# Altium project DIOT_Kasli_Adapter.PrjPCB (part 2 of 4)

## Sheet Cpcis_connectors_P4_P5_P6.SchDoc: DIOT_Kasli_Adapter
size 420 x 297 mm; CheckedBy: -; DrawnBy: Marcin Kiepiela; Address1: Warsaw University of Technology; Address2: Nowowiejska 15/19 00-665 Warsaw; DocumentNumber: 4; SheetNumber: 4; SheetTotal: 8; EDA_Number: ARTIQ; Projet: ARTIQ/Sinara/DIOT; ModifiedBy: -; CheckedDate: -; Title2: -; DivGrp: ISE; Designer: Marcin Kiepiela; ModifiedDate: -; ProjectName: DIOT_Kasli_Adapter.PrjPCB
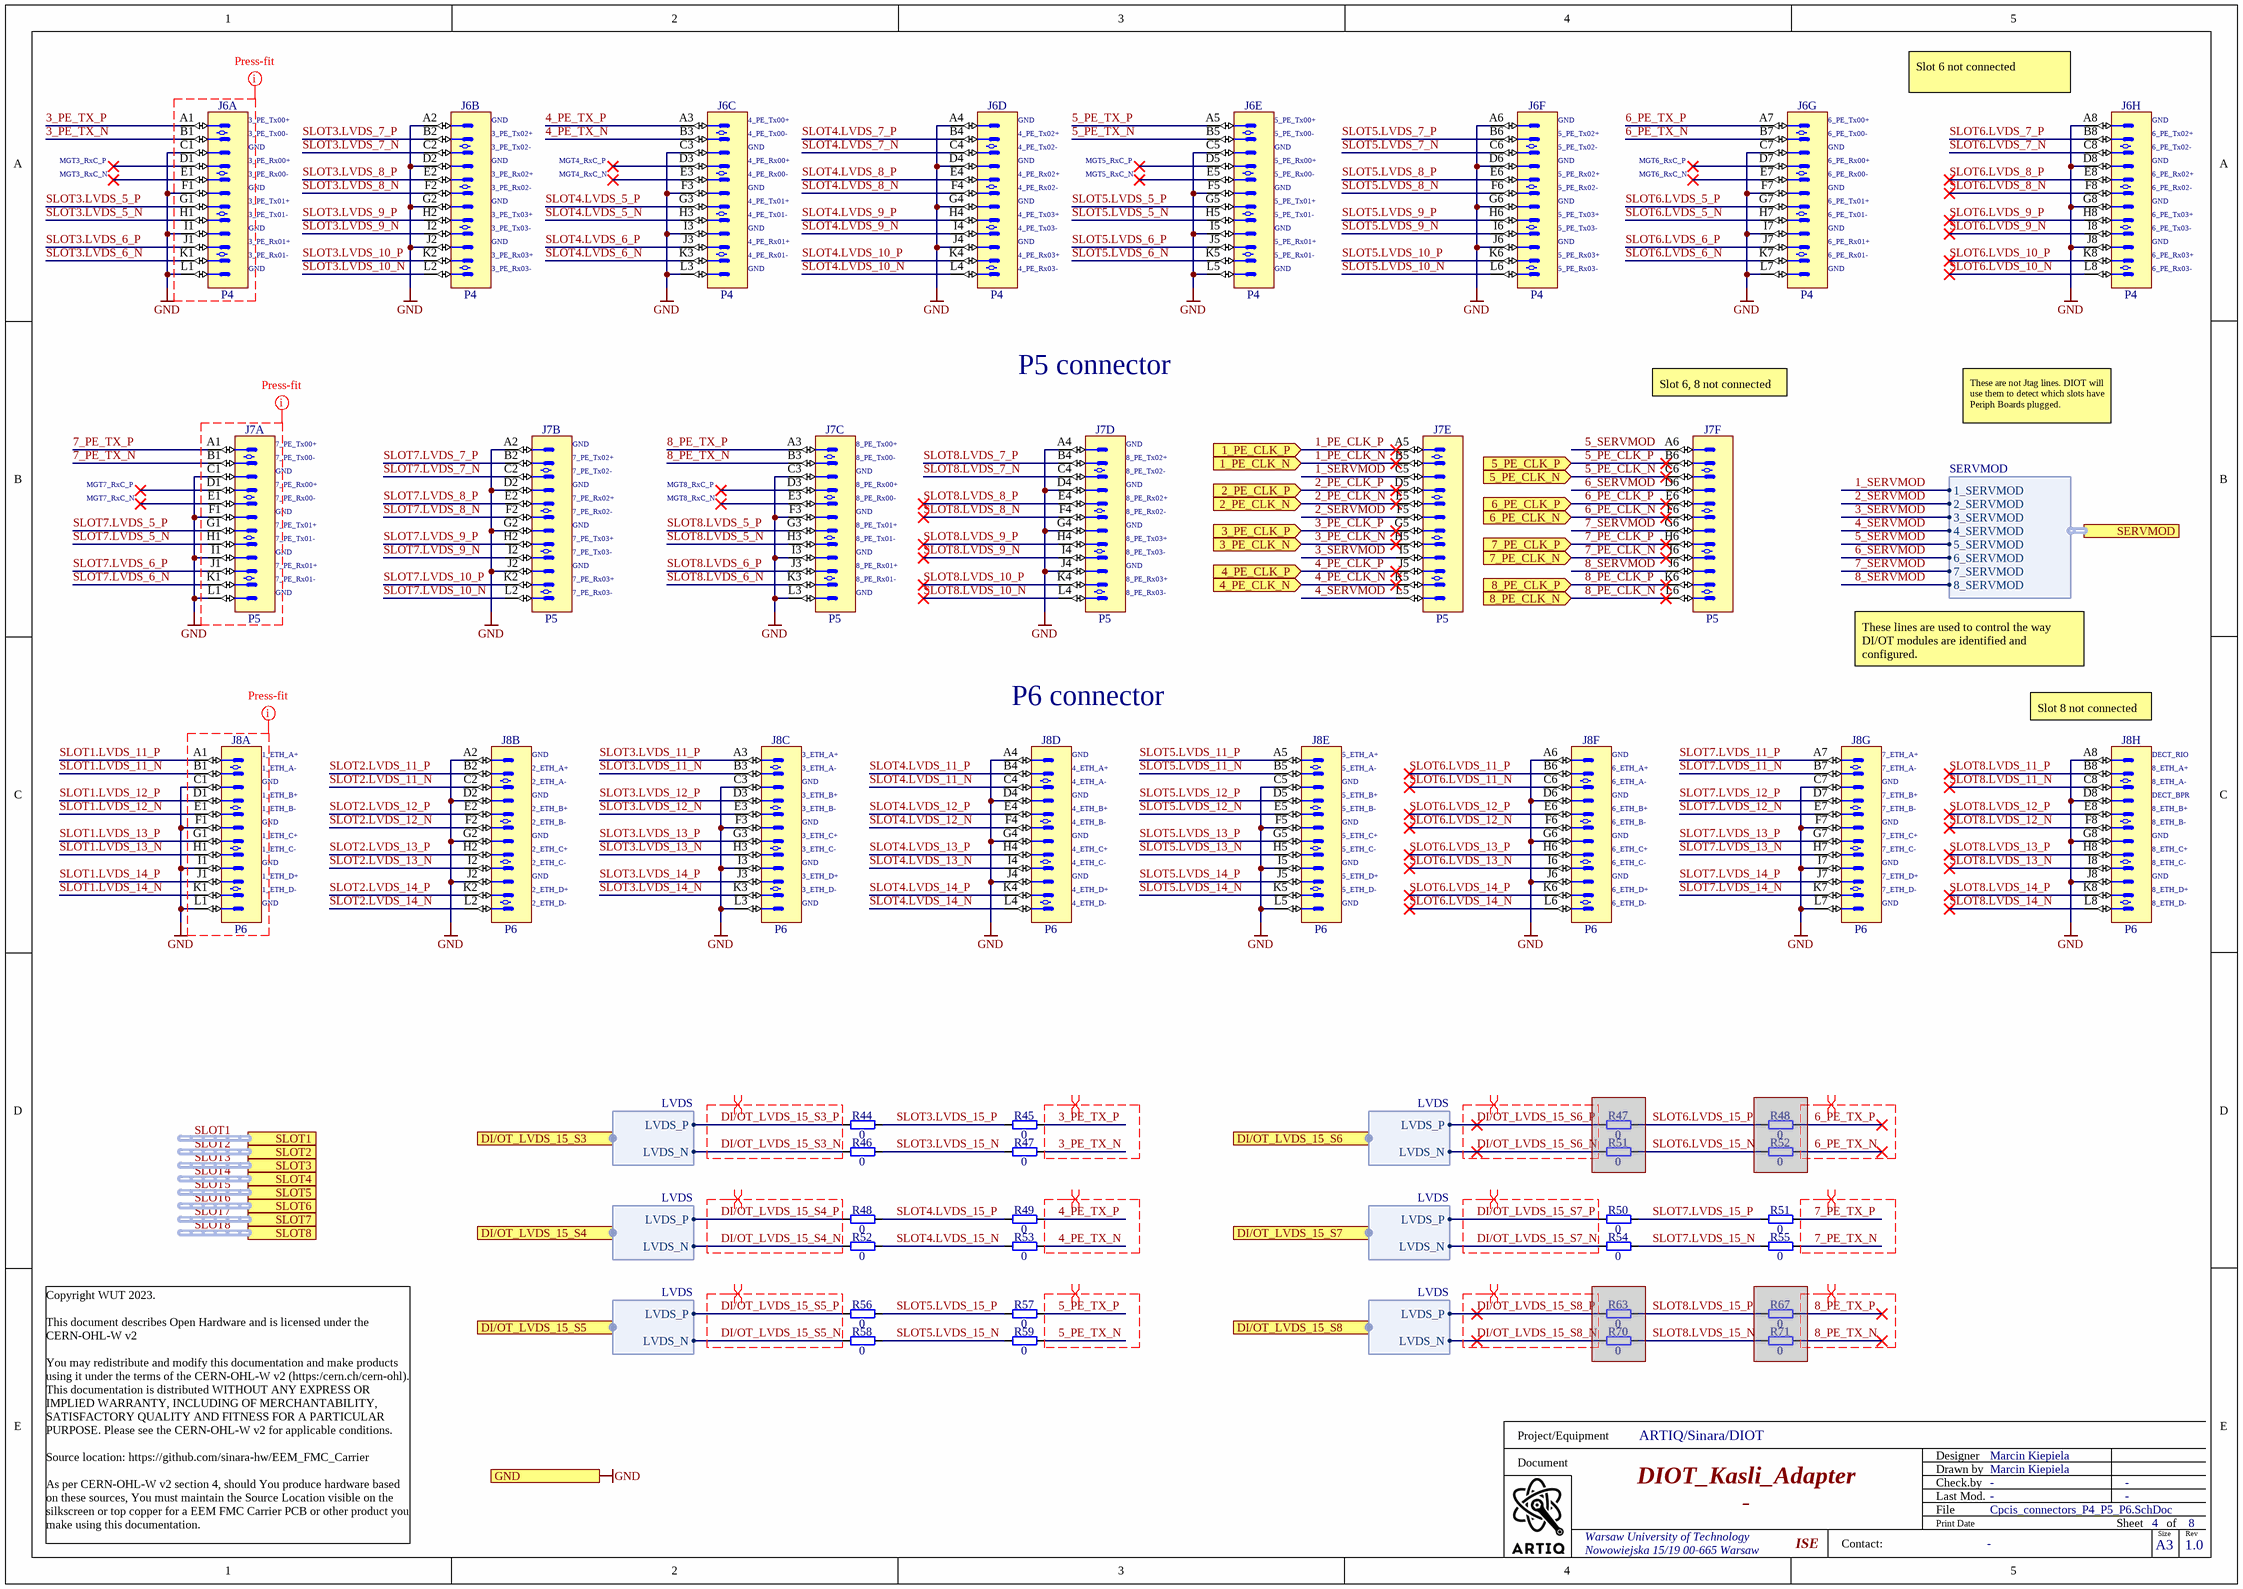
[diagram p2: Cpcis_connectors_P4_P5_P6.SchDoc]

### Parts
(Parts that share a designator on the sheet are numbered #1, #2 ... from top to bottom, then left to right.)
J6  P4  [AMPHENOL_10052837-101LF]  (parts A,B,C,D,E,F,G,H of 8)
J7  P5  [AMPHENOL_10052824-101LF]  (parts A,B,C,D,E,F of 6)
J8  P6  [AMPHENOL_10052838-101LF]  (parts A,B,C,D,E,F,G,H of 8)
R44  0  [RESC0603X28N]
R45  0  [RESC0603X28N]
R46  0  [RESC0603X28N]
R47#1  0  [RESC0603X28N]  (masked out: inside a compile mask, not in the netlist)
R47#2  0  [RESC0603X28N]
R48#1  0  [RESC0603X28N]  (masked out: inside a compile mask, not in the netlist)
R48#2  0  [RESC0603X28N]
R49  0  [RESC0603X28N]
R50  0  [RESC0603X28N]
R51#1  0  [RESC0603X28N]  (masked out: inside a compile mask, not in the netlist)
R51#2  0  [RESC0603X28N]
R52#1  0  [RESC0603X28N]  (masked out: inside a compile mask, not in the netlist)
R52#2  0  [RESC0603X28N]
R53  0  [RESC0603X28N]
R54  0  [RESC0603X28N]
R55  0  [RESC0603X28N]
R56  0  [RESC0603X28N]
R57  0  [RESC0603X28N]
R58  0  [RESC0603X28N]
R59  0  [RESC0603X28N]
R63  0  [RESC0603X28N]  (masked out: inside a compile mask, not in the netlist)
R67  0  [RESC0603X28N]  (masked out: inside a compile mask, not in the netlist)
R70  0  [RESC0603X28N]  (masked out: inside a compile mask, not in the netlist)
R71  0  [RESC0603X28N]  (masked out: inside a compile mask, not in the netlist)

### Ports
1_PE_CLK_N (in), 1_PE_CLK_P (in), 2_PE_CLK_N (in), 2_PE_CLK_P (in), 3_PE_CLK_N (in), 3_PE_CLK_P (in), 4_PE_CLK_N (in), 4_PE_CLK_P (in), 5_PE_CLK_N (in), 5_PE_CLK_P (in), 6_PE_CLK_N (in), 6_PE_CLK_P (in), 7_PE_CLK_N (in), 7_PE_CLK_P (in), 8_PE_CLK_N (in), 8_PE_CLK_P (in), DI/OT_LVDS_15_S3 (harness LVDS), DI/OT_LVDS_15_S4 (harness LVDS), DI/OT_LVDS_15_S5 (harness LVDS), DI/OT_LVDS_15_S6 (harness LVDS), DI/OT_LVDS_15_S7 (harness LVDS), DI/OT_LVDS_15_S8 (harness LVDS), GND, SERVMOD (harness SERVMOD), SLOT1 (harness SLOT), SLOT2 (harness SLOT), SLOT3 (harness SLOT), SLOT4 (harness SLOT), SLOT5 (harness SLOT), SLOT6 (harness ExtensionConnector), SLOT7 (harness SLOT), SLOT8 (harness ExtensionConnector)

### Harnesses
LVDS: LVDS_P, LVDS_N
SERVMOD: 5_SERVMOD, 6_SERVMOD, 2_SERVMOD, 7_SERVMOD, 3_SERVMOD, 4_SERVMOD, 1_SERVMOD, 8_SERVMOD

### Nets
GND: J6.A2 J6.A4 J6.A6 J6.A8 J6.C1 J6.C3 J6.C5 J6.C7 J6.D2 J6.D4 J6.D6 J6.D8 J6.F1 J6.F3 J6.F5 J6.F7 J6.G2 J6.G4 J6.G6 J6.G8 J6.I1 J6.I3 J6.I5 J6.I7 J6.J2 J6.J4 J6.J6 J6.J8 J6.L1 J6.L3 J6.L5 J6.L7 J7.A2 J7.A4 J7.C1 J7.C3 J7.D2 J7.D4 J7.F1 J7.F3 J7.G2 J7.G4 J7.I1 J7.I3 J7.J2 J7.J4 J7.L1 J7.L3 J8.A2 J8.A4 J8.A6 J8.A8 J8.C1 J8.C3 J8.C5 J8.C7 J8.D2 J8.D4 J8.D6 J8.D8 J8.F1 J8.F3 J8.F5 J8.F7 J8.G2 J8.G4 J8.G6 J8.G8 J8.I1 J8.I3 J8.I5 J8.I7 J8.J2 J8.J4 J8.J6 J8.J8 J8.L1 J8.L3 J8.L5 J8.L7 ; port GND
1_PE_CLK_N: J7.B5 ; port 1_PE_CLK_N
1_PE_CLK_P: J7.A5 ; port 1_PE_CLK_P
1_SERVMOD: J7.C5 ; port SERVMOD.1_SERVMOD  [project net SERVMOD.1_SERVMOD]
2_PE_CLK_N: J7.E5 ; port 2_PE_CLK_N
2_PE_CLK_P: J7.D5 ; port 2_PE_CLK_P
2_SERVMOD: J7.F5 ; port SERVMOD.2_SERVMOD  [project net SERVMOD.2_SERVMOD]
3_PE_CLK_N: J7.H5 ; port 3_PE_CLK_N
3_PE_CLK_P: J7.G5 ; port 3_PE_CLK_P
3_PE_TX_N: J6.B1 R47#2.2  [project net 3_PE_TX_N_4]
3_PE_TX_P: J6.A1 R45.2  [project net 3_PE_TX_P_4]
3_SERVMOD: J7.I5 ; port SERVMOD.3_SERVMOD  [project net SERVMOD.3_SERVMOD]
4_PE_CLK_N: J7.K5 ; port 4_PE_CLK_N
4_PE_CLK_P: J7.J5 ; port 4_PE_CLK_P
4_PE_TX_N: J6.B3 R53.2  [project net 4_PE_TX_N_4]
4_PE_TX_P: J6.A3 R49.2  [project net 4_PE_TX_P_4]
4_SERVMOD: J7.L5 ; port SERVMOD.4_SERVMOD  [project net SERVMOD.4_SERVMOD]
5_PE_CLK_N: J7.C6 ; port 5_PE_CLK_N
5_PE_CLK_P: J7.B6 ; port 5_PE_CLK_P
5_PE_TX_N: J6.B5 R59.2  [project net 5_PE_TX_N_4]
5_PE_TX_P: J6.A5 R57.2  [project net 5_PE_TX_P_4]
5_SERVMOD: J7.A6 ; port SERVMOD.5_SERVMOD  [project net SERVMOD.5_SERVMOD]
6_PE_CLK_N: J7.F6 ; port 6_PE_CLK_N
6_PE_CLK_P: J7.E6 ; port 6_PE_CLK_P
6_PE_TX_N: J6.B7  [project net 6_PE_TX_N_4]
6_PE_TX_P: J6.A7  [project net 6_PE_TX_P_4]
6_SERVMOD: J7.D6 ; port SERVMOD.6_SERVMOD  [project net SERVMOD.6_SERVMOD]
7_PE_CLK_N: J7.I6 ; port 7_PE_CLK_N
7_PE_CLK_P: J7.H6 ; port 7_PE_CLK_P
7_PE_TX_N: J7.B1 R55.2  [project net 7_PE_TX_N_4]
7_PE_TX_P: J7.A1 R51#2.2  [project net 7_PE_TX_P_4]
7_SERVMOD: J7.G6 ; port SERVMOD.7_SERVMOD  [project net SERVMOD.7_SERVMOD]
8_PE_CLK_N: J7.L6 ; port 8_PE_CLK_N
8_PE_CLK_P: J7.K6 ; port 8_PE_CLK_P
8_PE_TX_N: J7.B3  [project net 8_PE_TX_N_4]
8_PE_TX_P: J7.A3  [project net 8_PE_TX_P_4]
8_SERVMOD: J7.J6 ; port SERVMOD.8_SERVMOD  [project net SERVMOD.8_SERVMOD]
DI/OT_LVDS_15_S3_N: R46.1 ; port DI/OT_LVDS_15_S3.LVDS_N
DI/OT_LVDS_15_S3_P: R44.1 ; port DI/OT_LVDS_15_S3.LVDS_P
DI/OT_LVDS_15_S4_N: R52#2.1 ; port DI/OT_LVDS_15_S4.LVDS_N
DI/OT_LVDS_15_S4_P: R48#2.1 ; port DI/OT_LVDS_15_S4.LVDS_P
DI/OT_LVDS_15_S5_N: R58.1 ; port DI/OT_LVDS_15_S5.LVDS_N
DI/OT_LVDS_15_S5_P: R56.1 ; port DI/OT_LVDS_15_S5.LVDS_P
DI/OT_LVDS_15_S6_N: port DI/OT_LVDS_15_S6.LVDS_N
DI/OT_LVDS_15_S6_P: port DI/OT_LVDS_15_S6.LVDS_P
DI/OT_LVDS_15_S7_N: R54.1 ; port DI/OT_LVDS_15_S7.LVDS_N
DI/OT_LVDS_15_S7_P: R50.1 ; port DI/OT_LVDS_15_S7.LVDS_P
DI/OT_LVDS_15_S8_N: port DI/OT_LVDS_15_S8.LVDS_N
DI/OT_LVDS_15_S8_P: port DI/OT_LVDS_15_S8.LVDS_P
SLOT1.LVDS_11_N: J8.B1  [project net SLOT1.LVDS_11_N_4]
SLOT1.LVDS_11_P: J8.A1  [project net SLOT1.LVDS_11_P_4]
SLOT1.LVDS_12_N: J8.E1  [project net SLOT1.LVDS_12_N_4]
SLOT1.LVDS_12_P: J8.D1  [project net SLOT1.LVDS_12_P_4]
SLOT1.LVDS_13_N: J8.H1  [project net SLOT1.LVDS_13_N_4]
SLOT1.LVDS_13_P: J8.G1  [project net SLOT1.LVDS_13_P_4]
SLOT1.LVDS_14_N: J8.K1  [project net SLOT1.LVDS_14_N_4]
SLOT1.LVDS_14_P: J8.J1  [project net SLOT1.LVDS_14_P_4]
SLOT2.LVDS_11_N: J8.C2  [project net SLOT2.LVDS_11_N_4]
SLOT2.LVDS_11_P: J8.B2  [project net SLOT2.LVDS_11_P_4]
SLOT2.LVDS_12_N: J8.F2  [project net SLOT2.LVDS_12_N_4]
SLOT2.LVDS_12_P: J8.E2  [project net SLOT2.LVDS_12_P_4]
SLOT2.LVDS_13_N: J8.I2  [project net SLOT2.LVDS_13_N_4]
SLOT2.LVDS_13_P: J8.H2  [project net SLOT2.LVDS_13_P_4]
SLOT2.LVDS_14_N: J8.L2  [project net SLOT2.LVDS_14_N_4]
SLOT2.LVDS_14_P: J8.K2  [project net SLOT2.LVDS_14_P_4]
SLOT3.LVDS_5_N: J6.H1  [project net SLOT3.LVDS_5_N_4]
SLOT3.LVDS_5_P: J6.G1  [project net SLOT3.LVDS_5_P_4]
SLOT3.LVDS_6_N: J6.K1  [project net SLOT3.LVDS_6_N_4]
SLOT3.LVDS_6_P: J6.J1  [project net SLOT3.LVDS_6_P_4]
SLOT3.LVDS_7_N: J6.C2  [project net SLOT3.LVDS_7_N_4]
SLOT3.LVDS_7_P: J6.B2  [project net SLOT3.LVDS_7_P_4]
SLOT3.LVDS_8_N: J6.F2  [project net SLOT3.LVDS_8_N_4]
SLOT3.LVDS_8_P: J6.E2  [project net SLOT3.LVDS_8_P_4]
SLOT3.LVDS_9_N: J6.I2  [project net SLOT3.LVDS_9_N_4]
SLOT3.LVDS_9_P: J6.H2  [project net SLOT3.LVDS_9_P_4]
SLOT3.LVDS_10_N: J6.L2  [project net SLOT3.LVDS_10_N_4]
SLOT3.LVDS_10_P: J6.K2  [project net SLOT3.LVDS_10_P_4]
SLOT3.LVDS_11_N: J8.B3  [project net SLOT3.LVDS_11_N_4]
SLOT3.LVDS_11_P: J8.A3  [project net SLOT3.LVDS_11_P_4]
SLOT3.LVDS_12_N: J8.E3  [project net SLOT3.LVDS_12_N_4]
SLOT3.LVDS_12_P: J8.D3  [project net SLOT3.LVDS_12_P_4]
SLOT3.LVDS_13_N: J8.H3  [project net SLOT3.LVDS_13_N_4]
SLOT3.LVDS_13_P: J8.G3  [project net SLOT3.LVDS_13_P_4]
SLOT3.LVDS_14_N: J8.K3  [project net SLOT3.LVDS_14_N_4]
SLOT3.LVDS_14_P: J8.J3  [project net SLOT3.LVDS_14_P_4]
SLOT3.LVDS_15_N: R46.2 R47#2.1  [project net SLOT3.LVDS_15_N_4]
SLOT3.LVDS_15_P: R44.2 R45.1  [project net SLOT3.LVDS_15_P_4]
SLOT4.LVDS_5_N: J6.H3  [project net SLOT4.LVDS_5_N_4]
SLOT4.LVDS_5_P: J6.G3  [project net SLOT4.LVDS_5_P_4]
SLOT4.LVDS_6_N: J6.K3  [project net SLOT4.LVDS_6_N_4]
SLOT4.LVDS_6_P: J6.J3  [project net SLOT4.LVDS_6_P_4]
SLOT4.LVDS_7_N: J6.C4  [project net SLOT4.LVDS_7_N_4]
SLOT4.LVDS_7_P: J6.B4  [project net SLOT4.LVDS_7_P_4]
SLOT4.LVDS_8_N: J6.F4  [project net SLOT4.LVDS_8_N_4]
SLOT4.LVDS_8_P: J6.E4  [project net SLOT4.LVDS_8_P_4]
SLOT4.LVDS_9_N: J6.I4  [project net SLOT4.LVDS_9_N_4]
SLOT4.LVDS_9_P: J6.H4  [project net SLOT4.LVDS_9_P_4]
SLOT4.LVDS_10_N: J6.L4  [project net SLOT4.LVDS_10_N_4]
SLOT4.LVDS_10_P: J6.K4  [project net SLOT4.LVDS_10_P_4]
SLOT4.LVDS_11_N: J8.C4  [project net SLOT4.LVDS_11_N_4]
SLOT4.LVDS_11_P: J8.B4  [project net SLOT4.LVDS_11_P_4]
SLOT4.LVDS_12_N: J8.F4  [project net SLOT4.LVDS_12_N_4]
SLOT4.LVDS_12_P: J8.E4  [project net SLOT4.LVDS_12_P_4]
SLOT4.LVDS_13_N: J8.I4  [project net SLOT4.LVDS_13_N_4]
SLOT4.LVDS_13_P: J8.H4  [project net SLOT4.LVDS_13_P_4]
SLOT4.LVDS_14_N: J8.L4  [project net SLOT4.LVDS_14_N_4]
SLOT4.LVDS_14_P: J8.K4  [project net SLOT4.LVDS_14_P_4]
SLOT4.LVDS_15_N: R52#2.2 R53.1  [project net SLOT4.LVDS_15_N_4]
SLOT4.LVDS_15_P: R48#2.2 R49.1  [project net SLOT4.LVDS_15_P_4]
SLOT5.LVDS_5_N: J6.H5  [project net SLOT5.LVDS_5_N_4]
SLOT5.LVDS_5_P: J6.G5  [project net SLOT5.LVDS_5_P_4]
SLOT5.LVDS_6_N: J6.K5  [project net SLOT5.LVDS_6_N_4]
SLOT5.LVDS_6_P: J6.J5  [project net SLOT5.LVDS_6_P_4]
SLOT5.LVDS_7_N: J6.C6  [project net SLOT5.LVDS_7_N_4]
SLOT5.LVDS_7_P: J6.B6  [project net SLOT5.LVDS_7_P_4]
SLOT5.LVDS_8_N: J6.F6  [project net SLOT5.LVDS_8_N_4]
SLOT5.LVDS_8_P: J6.E6  [project net SLOT5.LVDS_8_P_4]
SLOT5.LVDS_9_N: J6.I6  [project net SLOT5.LVDS_9_N_4]
SLOT5.LVDS_9_P: J6.H6  [project net SLOT5.LVDS_9_P_4]
SLOT5.LVDS_10_N: J6.L6  [project net SLOT5.LVDS_10_N_4]
SLOT5.LVDS_10_P: J6.K6  [project net SLOT5.LVDS_10_P_4]
SLOT5.LVDS_11_N: J8.B5  [project net SLOT5.LVDS_11_N_4]
SLOT5.LVDS_11_P: J8.A5  [project net SLOT5.LVDS_11_P_4]
SLOT5.LVDS_12_N: J8.E5  [project net SLOT5.LVDS_12_N_4]
SLOT5.LVDS_12_P: J8.D5  [project net SLOT5.LVDS_12_P_4]
SLOT5.LVDS_13_N: J8.H5  [project net SLOT5.LVDS_13_N_4]
SLOT5.LVDS_13_P: J8.G5  [project net SLOT5.LVDS_13_P_4]
SLOT5.LVDS_14_N: J8.K5  [project net SLOT5.LVDS_14_N_4]
SLOT5.LVDS_14_P: J8.J5  [project net SLOT5.LVDS_14_P_4]
SLOT5.LVDS_15_N: R58.2 R59.1  [project net SLOT5.LVDS_15_N_4]
SLOT5.LVDS_15_P: R56.2 R57.1  [project net SLOT5.LVDS_15_P_4]
SLOT6.LVDS_5_N: J6.H7  [project net SLOT6.LVDS_5_N_4]
SLOT6.LVDS_5_P: J6.G7  [project net SLOT6.LVDS_5_P_4]
SLOT6.LVDS_6_N: J6.K7  [project net SLOT6.LVDS_6_N_4]
SLOT6.LVDS_6_P: J6.J7  [project net SLOT6.LVDS_6_P_4]
SLOT6.LVDS_7_N: J6.C8  [project net SLOT6.LVDS_7_N_4]
SLOT6.LVDS_7_P: J6.B8  [project net SLOT6.LVDS_7_P_4]
SLOT6.LVDS_8_N: J6.F8  [project net SLOT6.LVDS_8_N_4]
SLOT6.LVDS_8_P: J6.E8  [project net SLOT6.LVDS_8_P_4]
SLOT6.LVDS_9_N: J6.I8  [project net SLOT6.LVDS_9_N_4]
SLOT6.LVDS_9_P: J6.H8  [project net SLOT6.LVDS_9_P_4]
SLOT6.LVDS_10_N: J6.L8  [project net SLOT6.LVDS_10_N_4]
SLOT6.LVDS_10_P: J6.K8  [project net SLOT6.LVDS_10_P_4]
SLOT6.LVDS_11_N: J8.C6  [project net SLOT6.LVDS_11_N_4]
SLOT6.LVDS_11_P: J8.B6  [project net SLOT6.LVDS_11_P_4]
SLOT6.LVDS_12_N: J8.F6  [project net SLOT6.LVDS_12_N_4]
SLOT6.LVDS_12_P: J8.E6  [project net SLOT6.LVDS_12_P_4]
SLOT6.LVDS_13_N: J8.I6  [project net SLOT6.LVDS_13_N_4]
SLOT6.LVDS_13_P: J8.H6  [project net SLOT6.LVDS_13_P_4]
SLOT6.LVDS_14_N: J8.L6  [project net SLOT6.LVDS_14_N_4]
SLOT6.LVDS_14_P: J8.K6  [project net SLOT6.LVDS_14_P_4]
SLOT7.LVDS_5_N: J7.H1  [project net SLOT7.LVDS_5_N_4]
SLOT7.LVDS_5_P: J7.G1  [project net SLOT7.LVDS_5_P_4]
SLOT7.LVDS_6_N: J7.K1  [project net SLOT7.LVDS_6_N_4]
SLOT7.LVDS_6_P: J7.J1  [project net SLOT7.LVDS_6_P_4]
SLOT7.LVDS_7_N: J7.C2  [project net SLOT7.LVDS_7_N_4]
SLOT7.LVDS_7_P: J7.B2  [project net SLOT7.LVDS_7_P_4]
SLOT7.LVDS_8_N: J7.F2  [project net SLOT7.LVDS_8_N_4]
SLOT7.LVDS_8_P: J7.E2  [project net SLOT7.LVDS_8_P_4]
SLOT7.LVDS_9_N: J7.I2  [project net SLOT7.LVDS_9_N_4]
SLOT7.LVDS_9_P: J7.H2  [project net SLOT7.LVDS_9_P_4]
SLOT7.LVDS_10_N: J7.L2  [project net SLOT7.LVDS_10_N_4]
SLOT7.LVDS_10_P: J7.K2  [project net SLOT7.LVDS_10_P_4]
SLOT7.LVDS_11_N: J8.B7  [project net SLOT7.LVDS_11_N_4]
SLOT7.LVDS_11_P: J8.A7  [project net SLOT7.LVDS_11_P_4]
SLOT7.LVDS_12_N: J8.E7  [project net SLOT7.LVDS_12_N_4]
SLOT7.LVDS_12_P: J8.D7  [project net SLOT7.LVDS_12_P_4]
SLOT7.LVDS_13_N: J8.H7  [project net SLOT7.LVDS_13_N_4]
SLOT7.LVDS_13_P: J8.G7  [project net SLOT7.LVDS_13_P_4]
SLOT7.LVDS_14_N: J8.K7  [project net SLOT7.LVDS_14_N_4]
SLOT7.LVDS_14_P: J8.J7  [project net SLOT7.LVDS_14_P_4]
SLOT7.LVDS_15_N: R54.2 R55.1  [project net SLOT7.LVDS_15_N_4]
SLOT7.LVDS_15_P: R50.2 R51#2.1  [project net SLOT7.LVDS_15_P_4]
SLOT8.LVDS_5_N: J7.H3  [project net SLOT8.LVDS_5_N_4]
SLOT8.LVDS_5_P: J7.G3  [project net SLOT8.LVDS_5_P_4]
SLOT8.LVDS_6_N: J7.K3  [project net SLOT8.LVDS_6_N_4]
SLOT8.LVDS_6_P: J7.J3  [project net SLOT8.LVDS_6_P_4]
SLOT8.LVDS_7_N: J7.C4  [project net SLOT8.LVDS_7_N_4]
SLOT8.LVDS_7_P: J7.B4  [project net SLOT8.LVDS_7_P_4]
SLOT8.LVDS_8_N: J7.F4  [project net SLOT8.LVDS_8_N_4]
SLOT8.LVDS_8_P: J7.E4  [project net SLOT8.LVDS_8_P_4]
SLOT8.LVDS_9_N: J7.I4  [project net SLOT8.LVDS_9_N_4]
SLOT8.LVDS_9_P: J7.H4  [project net SLOT8.LVDS_9_P_4]
SLOT8.LVDS_10_N: J7.L4  [project net SLOT8.LVDS_10_N_4]
SLOT8.LVDS_10_P: J7.K4  [project net SLOT8.LVDS_10_P_4]
SLOT8.LVDS_11_N: J8.C8  [project net SLOT8.LVDS_11_N_4]
SLOT8.LVDS_11_P: J8.B8  [project net SLOT8.LVDS_11_P_4]
SLOT8.LVDS_12_N: J8.F8  [project net SLOT8.LVDS_12_N_4]
SLOT8.LVDS_12_P: J8.E8  [project net SLOT8.LVDS_12_P_4]
SLOT8.LVDS_13_N: J8.I8  [project net SLOT8.LVDS_13_N_4]
SLOT8.LVDS_13_P: J8.H8  [project net SLOT8.LVDS_13_P_4]
SLOT8.LVDS_14_N: J8.L8  [project net SLOT8.LVDS_14_N_4]
SLOT8.LVDS_14_P: J8.K8  [project net SLOT8.LVDS_14_P_4]

Not connected (* = marked no-connect by the designer): J6 D1* D3* D5* D7* E1* E3* E5* E7*; J7 D1* D3* E1* E3*

### Buses and harness runs
harness SLOT1 = port SLOT1
harness SLOT2 = port SLOT2
harness SLOT3 = port SLOT3
harness SLOT4 = port SLOT4
harness SLOT5 = port SLOT5
harness SLOT6 = port SLOT6
harness SLOT7 = port SLOT7
harness SLOT8 = port SLOT8

### Layout directives
differential pair: 3_PE_TX_N, 3_PE_TX_P, 4_PE_TX_N, 4_PE_TX_P, 5_PE_TX_N, 5_PE_TX_P, 6_PE_TX_N, 6_PE_TX_P, 7_PE_TX_N, 7_PE_TX_P, 8_PE_TX_N, 8_PE_TX_P, DI/OT_LVDS_15_S3_N, DI/OT_LVDS_15_S3_P, DI/OT_LVDS_15_S4_N, DI/OT_LVDS_15_S4_P, DI/OT_LVDS_15_S5_N, DI/OT_LVDS_15_S5_P, DI/OT_LVDS_15_S6_N, DI/OT_LVDS_15_S6_P, DI/OT_LVDS_15_S7_N, DI/OT_LVDS_15_S7_P, DI/OT_LVDS_15_S8_N, DI/OT_LVDS_15_S8_P
CompClassName: Press-fit: (no net found under the mark)

### Notes on the sheet
- (near J6) 3_PE_Tx00+
- (near J6) GND
- (near J6) 4_PE_Tx00+
- (near J6) 5_PE_Tx00+
- (near J6) 6_PE_Tx00+
- (near J6) Slot 6 not connected
- MGT3_RxC_P
- MGT3_RxC_N
- (near J6) 3_PE_Tx00-
- (near J6) 3_PE_Rx00+
- (near J6) 3_PE_Rx00-
- (near J6) 3_PE_Tx02+
- (near J6) 3_PE_Tx02-
- (near J6) 3_PE_Rx02+
- (near J6) 3_PE_Rx02-
- MGT4_RxC_P
- MGT4_RxC_N
- (near J6) 4_PE_Tx00-
- (near J6) 4_PE_Rx00+
- (near J6) 4_PE_Rx00-
- (near J6) 4_PE_Tx02+
- (near J6) 4_PE_Tx02-
- (near J6) 4_PE_Rx02+
- (near J6) 4_PE_Rx02-
- MGT5_RxC_P
- MGT5_RxC_N
- (near J6) 5_PE_Tx00-
- (near J6) 5_PE_Rx00+
- (near J6) 5_PE_Rx00-
- (near J6) 5_PE_Tx02+
- (near J6) 5_PE_Tx02-
- (near J6) 5_PE_Rx02+
- (near J6) 5_PE_Rx02-
- MGT6_RxC_P
- MGT6_RxC_N
- (near J6) 6_PE_Tx00-
- (near J6) 6_PE_Rx00+
- (near J6) 6_PE_Rx00-
- (near J6) 6_PE_Tx02+
- (near J6) 6_PE_Tx02-
- (near J6) 6_PE_Rx02+
- (near J6) 6_PE_Rx02-
- (near J6) 3_PE_Tx01+
- (near J6) 3_PE_Tx01-
- (near J6) 3_PE_Rx01+
- (near J6) 3_PE_Rx01-
- (near J6) 3_PE_Tx03+
- (near J6) 3_PE_Tx03-
- (near J6) 3_PE_Rx03+
- (near J6) 4_PE_Tx01+
- (near J6) 4_PE_Tx01-
- (near J6) 4_PE_Rx01+
- (near J6) 4_PE_Rx01-
- (near J6) 4_PE_Tx03+
- (near J6) 4_PE_Tx03-
- (near J6) 4_PE_Rx03+
- (near J6) 5_PE_Tx01+
- (near J6) 5_PE_Tx01-
- (near J6) 5_PE_Rx01+
- (near J6) 5_PE_Rx01-
- (near J6) 5_PE_Tx03+
- (near J6) 5_PE_Tx03-
- (near J6) 5_PE_Rx03+
- (near J6) 6_PE_Tx01+
- (near J6) 6_PE_Tx01-
- (near J6) 6_PE_Rx01+
- (near J6) 6_PE_Rx01-
- (near J6) 6_PE_Tx03+
- (near J6) 6_PE_Tx03-
- (near J6) 6_PE_Rx03+
- (near J6) 3_PE_Rx03-
- (near J6) 4_PE_Rx03-
- (near J6) 5_PE_Rx03-
- (near J6) 6_PE_Rx03-
- P5 connector
- Slot 6, 8 not connected
- (near J7) 7_PE_Tx00+
- (near J7) 7_PE_Tx00-
- (near J7) GND
- (near J7) 7_PE_Tx02+
- (near J7) 8_PE_Tx00+
- (near J7) 8_PE_Tx00-
- (near J7) 8_PE_Tx02+
- These are not Jtag lines. DIOT will use them to detect which slots have Periph Boards plugged.
- MGT7_RxC_P
- MGT7_RxC_N
- (near J7) 7_PE_Tx01+
- (near J7) 7_PE_Rx00+
- (near J7) 7_PE_Rx00-
- (near J7) 7_PE_Tx02-
- (near J7) 7_PE_Rx02+
- (near J7) 7_PE_Rx02-
- MGT8_RxC_P
- MGT8_RxC_N
- (near J7) 8_PE_Tx01+
- (near J7) 8_PE_Rx00+
- (near J7) 8_PE_Rx00-
- (near J7) 8_PE_Tx02-
- (near J7) 8_PE_Rx02+
- (near J7) 8_PE_Rx02-
- (near J7) 7_PE_Tx01-
- (near J7) 7_PE_Rx01+
- (near J7) 7_PE_Rx01-
- (near J7) 7_PE_Tx03+
- (near J7) 7_PE_Tx03-
- (near J7) 7_PE_Rx03+
- (near J7) 7_PE_Rx03-
- (near J7) 8_PE_Tx01-
- (near J7) 8_PE_Rx01+
- (near J7) 8_PE_Rx01-
- (near J7) 8_PE_Tx03+
- (near J7) 8_PE_Tx03-
- (near J7) 8_PE_Rx03+
- (near J7) 8_PE_Rx03-
- These lines are used to control the way DI/OT modules are identified and configured.
- (near J8) P6 connector
- (near J8) Slot 8 not connected
- (near J8) 1_ETH_A+
- (near J8) 1_ETH_A-
- (near J8) GND
- (near J8) 1_ETH_B+
- (near J8) 2_ETH_A+
- (near J8) 2_ETH_A-
- (near J8) 3_ETH_A+
- (near J8) 3_ETH_A-
- (near J8) 3_ETH_B+
- (near J8) 4_ETH_A+
- (near J8) 4_ETH_A-
- (near J8) 5_ETH_A+
- (near J8) 5_ETH_A-
- (near J8) 5_ETH_B+
- (near J8) 6_ETH_A+
- (near J8) 6_ETH_A-
- (near J8) 7_ETH_A+
- (near J8) 7_ETH_A-
- (near J8) 7_ETH_B+
- (near J8) DECT_RIO
- (near J8) 8_ETH_A+
- (near J8) 8_ETH_A-
- (near J8) DECT_BPR
- (near J8) 1_ETH_B-
- (near J8) 1_ETH_C+
- (near J8) 1_ETH_C-
- (near J8) 2_ETH_B+
- (near J8) 2_ETH_B-
- (near J8) 2_ETH_C+
- (near J8) 2_ETH_C-
- (near J8) 3_ETH_B-
- (near J8) 3_ETH_C+
- (near J8) 3_ETH_C-
- (near J8) 4_ETH_B+
- (near J8) 4_ETH_B-
- (near J8) 4_ETH_C+
- (near J8) 4_ETH_C-
- (near J8) 5_ETH_B-
- (near J8) 5_ETH_C+
- (near J8) 5_ETH_C-
- (near J8) 6_ETH_B+
- (near J8) 6_ETH_B-
- (near J8) 6_ETH_C+
- (near J8) 6_ETH_C-
- (near J8) 7_ETH_B-
- (near J8) 7_ETH_C+
- (near J8) 7_ETH_C-
- (near J8) 8_ETH_B+
- (near J8) 8_ETH_B-
- (near J8) 8_ETH_C+
- (near J8) 8_ETH_C-
- (near J8) 1_ETH_D+
- (near J8) 1_ETH_D-
- (near J8) 2_ETH_D+
- (near J8) 2_ETH_D-
- (near J8) 3_ETH_D+
- (near J8) 3_ETH_D-
- (near J8) 4_ETH_D+
- (near J8) 4_ETH_D-
- (near J8) 5_ETH_D+
- (near J8) 5_ETH_D-
- (near J8) 6_ETH_D+
- (near J8) 6_ETH_D-
- (near J8) 7_ETH_D+
- (near J8) 7_ETH_D-
- (near J8) 8_ETH_D+
- (near J8) 8_ETH_D-
- Labels drawn without touching a wire or pin: SLOT6.LVDS_15_N, SLOT6.LVDS_15_P, SLOT8.LVDS_15_N, SLOT8.LVDS_15_P
- Project/Equipment
- Document
- Designer
- Drawn by
- Check.by
- Copyright WUT 2023.
  This document describes Open Hardware and is licensed under the CERN-OHL-W v2
  You may redistribute and modify this documentation and make products using it under the terms of the CERN-OHL-W v2 (https:/cern.ch/cern-ohl). This documentation is distributed WITHOUT ANY EXPRESS OR IMPLIED WARRANTY, INCLUDING OF MERCHANTABILITY, SATISFACTORY QUALITY AND FITNESS FOR A PARTICULAR PURPOSE. Please see the CERN-OHL-W v2 for applicable conditions.
  Source location: https://github.com/sinara-hw/EEM_FMC_Carrier
  As per CERN-OHL-W v2 section 4, should You produce hardware based on these sources, You must maintain the Source Location visible on the silkscreen or top copper for a EEM FMC Carrier PCB or other product you make using this documentation.
- Contact:
- File
- Last Mod.
- Print Date
- Sheet
- Size
- A3
- of
- Rev

### Library data of the parts
J6 = AMPHENOL_10052837-101LF: 96 Contacts Header, 8 Columns, 4 Pairs per Column; Part Description: 96 Contacts, 2mm Pitch, 8 Columns, 4 Pairs per Column, 2 Walls, Right Angle Header; Part Number: AMPHENOL_10052837-101LF; Component Kind: Standard; Component Type: Standard; Pin Count: 96; Family: AirMax VS; Mounted: Yes; Socket: No; SMD: No; PressFit: Yes; Sense: No; Status: None; Manufacturer: AMPHENOL; Manufacturer Part Number: 10052837-101LF; ComponentHeight: 15.35mm; HelpURL: \\cern.ch\dfs\Applications\Altium\Datasheets\AMPHENOL_10052837-101LF.pdf; ComponentLink1URL: \\cern.ch\dfs\Applications\Altium\Datasheets\AMPHENOL_10052837-101LF_Application.pdf; ComponentLink1Description: Application; Author: CERN DEM MR; CreateDate: 19/02/2018; LatestRevisionDate: 19/02/2018
J7 = AMPHENOL_10052824-101LF: 72 Contacts Header, 6 Columns, 4 Pairs per Column; Part Description: 72 Contacts, 2mm Pitch, 6 Columns, 4 Pairs per Column, 2 Walls, Right Angle Header; Part Number: AMPHENOL_10052824-101LF; Component Kind: Standard; Component Type: Standard; Pin Count: 72; Family: AirMax VS; Mounted: Yes; Socket: No; SMD: No; PressFit: Yes; Sense: No; Status: None; Manufacturer: AMPHENOL; Manufacturer Part Number: 10052824-101LF; ComponentHeight: 15.35mm; HelpURL: \\cern.ch\dfs\Applications\Altium\Datasheets\AMPHENOL_10052824-101LF.pdf; ComponentLink1URL: \\cern.ch\dfs\Applications\Altium\Datasheets\AMPHENOL_10052824-101LF_Application.pdf; ComponentLink1Description: Application; Author: CERN DEM JMW; CreateDate: 29/11/2017; LatestRevisionDate: 29/11/2017
J8 = AMPHENOL_10052838-101LF: 96 Contacts Header, 8 Columns, 4 Pairs per Column; Part Description: 96 Contacts, 2mm Pitch, 8 Columns, 4 Pairs per Column, 4 Walls, Right Angle Header; Part Number: AMPHENOL_10052838-101LF; Component Kind: Standard; Component Type: Standard; Pin Count: 96; Family: AirMax VS; Mounted: Yes; Socket: No; SMD: No; PressFit: Yes; Sense: No; Status: None; Manufacturer: AMPHENOL; Manufacturer Part Number: 10052838-101LF; ComponentHeight: 15.35mm; HelpURL: \\cern.ch\dfs\Applications\Altium\Datasheets\AMPHENOL_10052838-101LF.pdf; ComponentLink1URL: \\cern.ch\dfs\Applications\Altium\Datasheets\AMPHENOL_10052838-101LF_Application.pdf; ComponentLink1Description: Application; Author: CERN DEM MR; CreateDate: 19/02/2018; LatestRevisionDate: 19/02/2018; Classname: Overlapping
R44-R46 R47#1 R47#2 R48#1 R48#2 R49 R50 R51#1 R51#2 R52#1 R52#2 R53-R59 R63 R67 R70 R71 = R0201_0R_JUMPER: Resistor; Part Description: 1A (0.05R Max DC Resistance) Zero Ohm Jumper; Manufacturer: GENERIC; Manufacturer1 Part Number: CRCW02010000Z0ED; PressFit: No; Part Number: R0201_0R_JUMPER; Component Kind: Standard; Component Type: Standard; Pin Count: 2; Value: 0; Status: Not Recommended; Manufacturer Part Number: R0201_0R_JUMPER; Case: 0201; Mounted: Yes; Sense: No; Socket: No; SMD: Yes; Manufacturer1 Example: VISHAY; Manufacturer1 ComponentHeight: 0.27mm; HelpURL: \\cern.ch\dfs\Applications\Altium\Datasheets\R0201_VISHAY_CRCW e3.pdf; Author: CERN DEM JLC; CreateDate: 19.11.2014; LatestRevisionDate: 08.01.2015

## Sheet IDC_EXT_Connectors.SchDoc: DIOT_Kasli_Adapter
size 420 x 297 mm; CheckedBy: -; DrawnBy: Marcin Kiepiela; Address1: Warsaw University of Technology; Address2: Nowowiejska 15/19 00-665 Warsaw; DocumentNumber: 5; SheetNumber: 5; SheetTotal: 8; EDA_Number: ARTIQ; Projet: ARTIQ/Sinara/DIOT; ModifiedBy: -; CheckedDate: -; Title2: -; DivGrp: ISE; Designer: Marcin Kiepiela; ModifiedDate: -; ProjectName: DIOT_Kasli_Adapter.PrjPCB
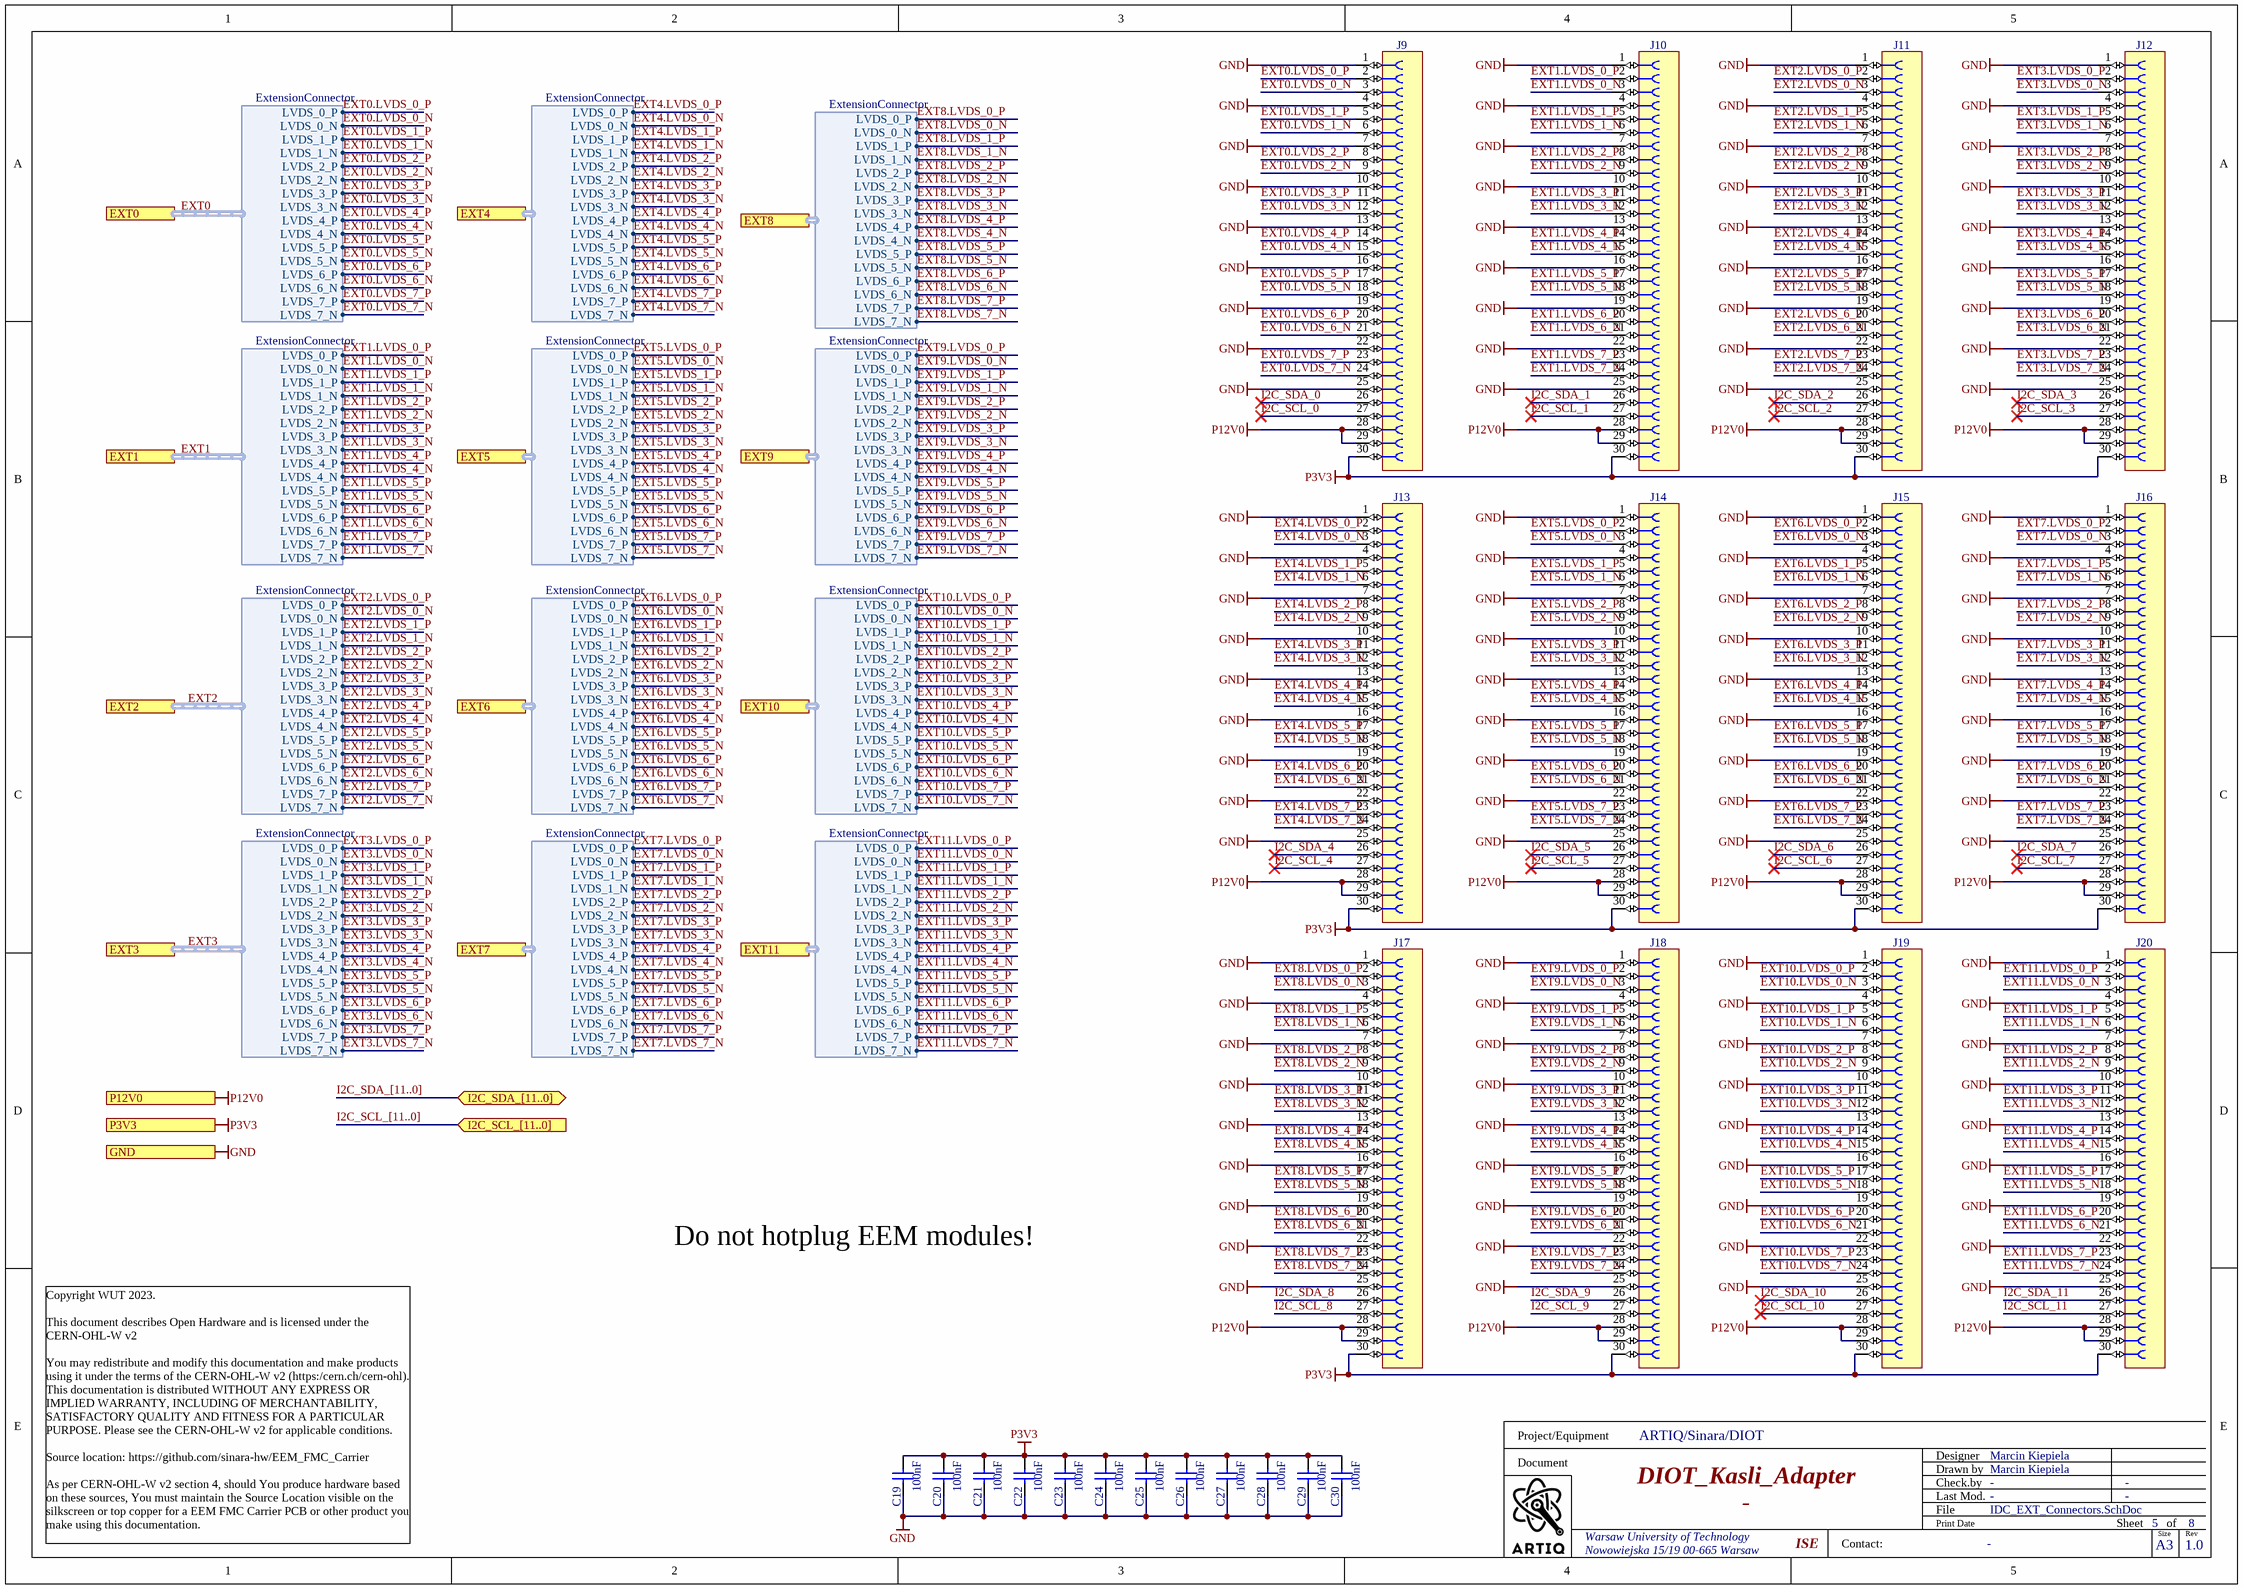
[diagram p3: IDC_EXT_Connectors.SchDoc]

### Parts
C19  100nF  [CAPC0603X33N]
C20  100nF  [CAPC0603X33N]
C21  100nF  [CAPC0603X33N]
C22  100nF  [CAPC0603X33N]
C23  100nF  [CAPC0603X33N]
C24  100nF  [CAPC0603X33N]
C25  100nF  [CAPC0603X33N]
C26  100nF  [CAPC0603X33N]
C27  100nF  [CAPC0603X33N]
C28  100nF  [CAPC0603X33N]
C29  100nF  [CAPC0603X33N]
C30  100nF  [CAPC0603X33N]
J9  (no value)  [SAMTEC_ESW-115-44-L-D]
J10  (no value)  [SAMTEC_ESW-115-44-L-D]
J11  (no value)  [SAMTEC_ESW-115-44-L-D]
J12  (no value)  [SAMTEC_ESW-115-44-L-D]
J13  (no value)  [SAMTEC_ESW-115-44-L-D]
J14  (no value)  [SAMTEC_ESW-115-44-L-D]
J15  (no value)  [SAMTEC_ESW-115-44-L-D]
J16  (no value)  [SAMTEC_ESW-115-44-L-D]
J17  (no value)  [SAMTEC_ESW-115-44-L-D]
J18  (no value)  [SAMTEC_ESW-115-44-L-D]
J19  (no value)  [SAMTEC_ESW-115-44-L-D]
J20  (no value)  [SAMTEC_ESW-115-44-L-D]

### Ports
EXT0 (harness ExtensionConnector), EXT1 (harness ExtensionConnector), EXT2 (harness ExtensionConnector), EXT3 (harness ExtensionConnector), EXT4 (harness ExtensionConnector), EXT5 (harness ExtensionConnector), EXT6 (harness ExtensionConnector), EXT7 (harness ExtensionConnector), EXT8 (harness ExtensionConnector), EXT9 (harness ExtensionConnector), EXT10 (harness ExtensionConnector), EXT11 (harness ExtensionConnector), GND, I2C_SCL_[11..0] (in), I2C_SDA_[11..0] (bidir), P3V3 (out), P12V0 (in)

### Harnesses
ExtensionConnector: LVDS_0_N, LVDS_0_P, LVDS_1_N, LVDS_1_P, LVDS_2_N, LVDS_2_P, LVDS_3_N, LVDS_3_P, LVDS_4_N, LVDS_4_P, LVDS_5_N, LVDS_5_P, LVDS_6_N, LVDS_6_P, LVDS_7_N, LVDS_7_P

### Nets
GND: C19.1 C20.1 C21.1 C22.1 C23.1 C24.1 C25.1 C26.1 C27.1 C28.1 C29.1 C30.1 J9.1 J9.4 J9.7 J9.10 J9.13 J9.16 J9.19 J9.22 J9.25 J10.1 J10.4 J10.7 J10.10 J10.13 J10.16 J10.19 J10.22 J10.25 J11.1 J11.4 J11.7 J11.10 J11.13 J11.16 J11.19 J11.22 J11.25 J12.1 J12.4 J12.7 J12.10 J12.13 J12.16 J12.19 J12.22 J12.25 J13.1 J13.4 J13.7 J13.10 J13.13 J13.16 J13.19 J13.22 J13.25 J14.1 J14.4 J14.7 J14.10 J14.13 J14.16 J14.19 J14.22 J14.25 J15.1 J15.4 J15.7 J15.10 J15.13 J15.16 J15.19 J15.22 J15.25 J16.1 J16.4 J16.7 J16.10 J16.13 J16.16 J16.19 J16.22 J16.25 J17.1 J17.4 J17.7 J17.10 J17.13 J17.16 J17.19 J17.22 J17.25 J18.1 J18.4 J18.7 J18.10 J18.13 J18.16 J18.19 J18.22 J18.25 J19.1 J19.4 J19.7 J19.10 J19.13 J19.16 J19.19 J19.22 J19.25 J20.1 J20.4 J20.7 J20.10 J20.13 J20.16 J20.19 J20.22 J20.25 ; port GND
P3V3: C19.2 C20.2 C21.2 C22.2 C23.2 C24.2 C25.2 C26.2 C27.2 C28.2 C29.2 C30.2 J9.30 J10.30 J11.30 J12.30 J13.30 J14.30 J15.30 J16.30 J17.30 J18.30 J19.30 J20.30 ; port P3V3
P12V0: J9.28 J9.29 J10.28 J10.29 J11.28 J11.29 J12.28 J12.29 J13.28 J13.29 J14.28 J14.29 J15.28 J15.29 J16.28 J16.29 J17.28 J17.29 J18.28 J18.29 J19.28 J19.29 J20.28 J20.29 ; port P12V0
EXT0.LVDS_0_N: J9.3 ; port EXT0.LVDS_0_N
EXT0.LVDS_0_P: J9.2 ; port EXT0.LVDS_0_P
EXT0.LVDS_1_N: J9.6 ; port EXT0.LVDS_1_N
EXT0.LVDS_1_P: J9.5 ; port EXT0.LVDS_1_P
EXT0.LVDS_2_N: J9.9 ; port EXT0.LVDS_2_N
EXT0.LVDS_2_P: J9.8 ; port EXT0.LVDS_2_P
EXT0.LVDS_3_N: J9.12 ; port EXT0.LVDS_3_N
EXT0.LVDS_3_P: J9.11 ; port EXT0.LVDS_3_P
EXT0.LVDS_4_N: J9.15 ; port EXT0.LVDS_4_N
EXT0.LVDS_4_P: J9.14 ; port EXT0.LVDS_4_P
EXT0.LVDS_5_N: J9.18 ; port EXT0.LVDS_5_N
EXT0.LVDS_5_P: J9.17 ; port EXT0.LVDS_5_P
EXT0.LVDS_6_N: J9.21 ; port EXT0.LVDS_6_N
EXT0.LVDS_6_P: J9.20 ; port EXT0.LVDS_6_P
EXT0.LVDS_7_N: J9.24 ; port EXT0.LVDS_7_N
EXT0.LVDS_7_P: J9.23 ; port EXT0.LVDS_7_P
EXT1.LVDS_0_N: J10.3 ; port EXT1.LVDS_0_N
EXT1.LVDS_0_P: J10.2 ; port EXT1.LVDS_0_P
EXT1.LVDS_1_N: J10.6 ; port EXT1.LVDS_1_N
EXT1.LVDS_1_P: J10.5 ; port EXT1.LVDS_1_P
EXT1.LVDS_2_N: J10.9 ; port EXT1.LVDS_2_N
EXT1.LVDS_2_P: J10.8 ; port EXT1.LVDS_2_P
EXT1.LVDS_3_N: J10.12 ; port EXT1.LVDS_3_N
EXT1.LVDS_3_P: J10.11 ; port EXT1.LVDS_3_P
EXT1.LVDS_4_N: J10.15 ; port EXT1.LVDS_4_N
EXT1.LVDS_4_P: J10.14 ; port EXT1.LVDS_4_P
EXT1.LVDS_5_N: J10.18 ; port EXT1.LVDS_5_N
EXT1.LVDS_5_P: J10.17 ; port EXT1.LVDS_5_P
EXT1.LVDS_6_N: J10.21 ; port EXT1.LVDS_6_N
EXT1.LVDS_6_P: J10.20 ; port EXT1.LVDS_6_P
EXT1.LVDS_7_N: J10.24 ; port EXT1.LVDS_7_N
EXT1.LVDS_7_P: J10.23 ; port EXT1.LVDS_7_P
EXT2.LVDS_0_N: J11.3 ; port EXT2.LVDS_0_N
EXT2.LVDS_0_P: J11.2 ; port EXT2.LVDS_0_P
EXT2.LVDS_1_N: J11.6 ; port EXT2.LVDS_1_N
EXT2.LVDS_1_P: J11.5 ; port EXT2.LVDS_1_P
EXT2.LVDS_2_N: J11.9 ; port EXT2.LVDS_2_N
EXT2.LVDS_2_P: J11.8 ; port EXT2.LVDS_2_P
EXT2.LVDS_3_N: J11.12 ; port EXT2.LVDS_3_N
EXT2.LVDS_3_P: J11.11 ; port EXT2.LVDS_3_P
EXT2.LVDS_4_N: J11.15 ; port EXT2.LVDS_4_N
EXT2.LVDS_4_P: J11.14 ; port EXT2.LVDS_4_P
EXT2.LVDS_5_N: J11.18 ; port EXT2.LVDS_5_N
EXT2.LVDS_5_P: J11.17 ; port EXT2.LVDS_5_P
EXT2.LVDS_6_N: J11.21 ; port EXT2.LVDS_6_N
EXT2.LVDS_6_P: J11.20 ; port EXT2.LVDS_6_P
EXT2.LVDS_7_N: J11.24 ; port EXT2.LVDS_7_N
EXT2.LVDS_7_P: J11.23 ; port EXT2.LVDS_7_P
EXT3.LVDS_0_N: J12.3 ; port EXT3.LVDS_0_N
EXT3.LVDS_0_P: J12.2 ; port EXT3.LVDS_0_P
EXT3.LVDS_1_N: J12.6 ; port EXT3.LVDS_1_N
EXT3.LVDS_1_P: J12.5 ; port EXT3.LVDS_1_P
EXT3.LVDS_2_N: J12.9 ; port EXT3.LVDS_2_N
EXT3.LVDS_2_P: J12.8 ; port EXT3.LVDS_2_P
EXT3.LVDS_3_N: J12.12 ; port EXT3.LVDS_3_N
EXT3.LVDS_3_P: J12.11 ; port EXT3.LVDS_3_P
EXT3.LVDS_4_N: J12.15 ; port EXT3.LVDS_4_N
EXT3.LVDS_4_P: J12.14 ; port EXT3.LVDS_4_P
EXT3.LVDS_5_N: J12.18 ; port EXT3.LVDS_5_N
EXT3.LVDS_5_P: J12.17 ; port EXT3.LVDS_5_P
EXT3.LVDS_6_N: J12.21 ; port EXT3.LVDS_6_N
EXT3.LVDS_6_P: J12.20 ; port EXT3.LVDS_6_P
EXT3.LVDS_7_N: J12.24 ; port EXT3.LVDS_7_N
EXT3.LVDS_7_P: J12.23 ; port EXT3.LVDS_7_P
EXT4.LVDS_0_N: J13.3 ; port EXT4.LVDS_0_N
EXT4.LVDS_0_P: J13.2 ; port EXT4.LVDS_0_P
EXT4.LVDS_1_N: J13.6 ; port EXT4.LVDS_1_N
EXT4.LVDS_1_P: J13.5 ; port EXT4.LVDS_1_P
EXT4.LVDS_2_N: J13.9 ; port EXT4.LVDS_2_N
EXT4.LVDS_2_P: J13.8 ; port EXT4.LVDS_2_P
EXT4.LVDS_3_N: J13.12 ; port EXT4.LVDS_3_N
EXT4.LVDS_3_P: J13.11 ; port EXT4.LVDS_3_P
EXT4.LVDS_4_N: J13.15 ; port EXT4.LVDS_4_N
EXT4.LVDS_4_P: J13.14 ; port EXT4.LVDS_4_P
EXT4.LVDS_5_N: J13.18 ; port EXT4.LVDS_5_N
EXT4.LVDS_5_P: J13.17 ; port EXT4.LVDS_5_P
EXT4.LVDS_6_N: J13.21 ; port EXT4.LVDS_6_N
EXT4.LVDS_6_P: J13.20 ; port EXT4.LVDS_6_P
EXT4.LVDS_7_N: J13.24 ; port EXT4.LVDS_7_N
EXT4.LVDS_7_P: J13.23 ; port EXT4.LVDS_7_P
EXT5.LVDS_0_N: J14.3 ; port EXT5.LVDS_0_N
EXT5.LVDS_0_P: J14.2 ; port EXT5.LVDS_0_P
EXT5.LVDS_1_N: J14.6 ; port EXT5.LVDS_1_N
EXT5.LVDS_1_P: J14.5 ; port EXT5.LVDS_1_P
EXT5.LVDS_2_N: J14.9 ; port EXT5.LVDS_2_N
EXT5.LVDS_2_P: J14.8 ; port EXT5.LVDS_2_P
EXT5.LVDS_3_N: J14.12 ; port EXT5.LVDS_3_N
EXT5.LVDS_3_P: J14.11 ; port EXT5.LVDS_3_P
EXT5.LVDS_4_N: J14.15 ; port EXT5.LVDS_4_N
EXT5.LVDS_4_P: J14.14 ; port EXT5.LVDS_4_P
EXT5.LVDS_5_N: J14.18 ; port EXT5.LVDS_5_N
EXT5.LVDS_5_P: J14.17 ; port EXT5.LVDS_5_P
EXT5.LVDS_6_N: J14.21 ; port EXT5.LVDS_6_N
EXT5.LVDS_6_P: J14.20 ; port EXT5.LVDS_6_P
EXT5.LVDS_7_N: J14.24 ; port EXT5.LVDS_7_N
EXT5.LVDS_7_P: J14.23 ; port EXT5.LVDS_7_P
EXT6.LVDS_0_N: J15.3 ; port EXT6.LVDS_0_N
EXT6.LVDS_0_P: J15.2 ; port EXT6.LVDS_0_P
EXT6.LVDS_1_N: J15.6 ; port EXT6.LVDS_1_N
EXT6.LVDS_1_P: J15.5 ; port EXT6.LVDS_1_P
EXT6.LVDS_2_N: J15.9 ; port EXT6.LVDS_2_N
EXT6.LVDS_2_P: J15.8 ; port EXT6.LVDS_2_P
EXT6.LVDS_3_N: J15.12 ; port EXT6.LVDS_3_N
EXT6.LVDS_3_P: J15.11 ; port EXT6.LVDS_3_P
EXT6.LVDS_4_N: J15.15 ; port EXT6.LVDS_4_N
EXT6.LVDS_4_P: J15.14 ; port EXT6.LVDS_4_P
EXT6.LVDS_5_N: J15.18 ; port EXT6.LVDS_5_N
EXT6.LVDS_5_P: J15.17 ; port EXT6.LVDS_5_P
EXT6.LVDS_6_N: J15.21 ; port EXT6.LVDS_6_N
EXT6.LVDS_6_P: J15.20 ; port EXT6.LVDS_6_P
EXT6.LVDS_7_N: J15.24 ; port EXT6.LVDS_7_N
EXT6.LVDS_7_P: J15.23 ; port EXT6.LVDS_7_P
EXT7.LVDS_0_N: J16.3 ; port EXT7.LVDS_0_N
EXT7.LVDS_0_P: J16.2 ; port EXT7.LVDS_0_P
EXT7.LVDS_1_N: J16.6 ; port EXT7.LVDS_1_N
EXT7.LVDS_1_P: J16.5 ; port EXT7.LVDS_1_P
EXT7.LVDS_2_N: J16.9 ; port EXT7.LVDS_2_N
EXT7.LVDS_2_P: J16.8 ; port EXT7.LVDS_2_P
EXT7.LVDS_3_N: J16.12 ; port EXT7.LVDS_3_N
EXT7.LVDS_3_P: J16.11 ; port EXT7.LVDS_3_P
EXT7.LVDS_4_N: J16.15 ; port EXT7.LVDS_4_N
EXT7.LVDS_4_P: J16.14 ; port EXT7.LVDS_4_P
EXT7.LVDS_5_N: J16.18 ; port EXT7.LVDS_5_N
EXT7.LVDS_5_P: J16.17 ; port EXT7.LVDS_5_P
EXT7.LVDS_6_N: J16.21 ; port EXT7.LVDS_6_N
EXT7.LVDS_6_P: J16.20 ; port EXT7.LVDS_6_P
EXT7.LVDS_7_N: J16.24 ; port EXT7.LVDS_7_N
EXT7.LVDS_7_P: J16.23 ; port EXT7.LVDS_7_P
EXT8.LVDS_0_N: J17.3 ; port EXT8.LVDS_0_N
EXT8.LVDS_0_P: J17.2 ; port EXT8.LVDS_0_P
EXT8.LVDS_1_N: J17.6 ; port EXT8.LVDS_1_N
EXT8.LVDS_1_P: J17.5 ; port EXT8.LVDS_1_P
EXT8.LVDS_2_N: J17.9 ; port EXT8.LVDS_2_N
EXT8.LVDS_2_P: J17.8 ; port EXT8.LVDS_2_P
EXT8.LVDS_3_N: J17.12 ; port EXT8.LVDS_3_N
EXT8.LVDS_3_P: J17.11 ; port EXT8.LVDS_3_P
EXT8.LVDS_4_N: J17.15 ; port EXT8.LVDS_4_N
EXT8.LVDS_4_P: J17.14 ; port EXT8.LVDS_4_P
EXT8.LVDS_5_N: J17.18 ; port EXT8.LVDS_5_N
EXT8.LVDS_5_P: J17.17 ; port EXT8.LVDS_5_P
EXT8.LVDS_6_N: J17.21 ; port EXT8.LVDS_6_N
EXT8.LVDS_6_P: J17.20 ; port EXT8.LVDS_6_P
EXT8.LVDS_7_N: J17.24 ; port EXT8.LVDS_7_N
EXT8.LVDS_7_P: J17.23 ; port EXT8.LVDS_7_P
EXT9.LVDS_0_N: J18.3 ; port EXT9.LVDS_0_N
EXT9.LVDS_0_P: J18.2 ; port EXT9.LVDS_0_P
EXT9.LVDS_1_N: J18.6 ; port EXT9.LVDS_1_N
EXT9.LVDS_1_P: J18.5 ; port EXT9.LVDS_1_P
EXT9.LVDS_2_N: J18.9 ; port EXT9.LVDS_2_N
EXT9.LVDS_2_P: J18.8 ; port EXT9.LVDS_2_P
EXT9.LVDS_3_N: J18.12 ; port EXT9.LVDS_3_N
EXT9.LVDS_3_P: J18.11 ; port EXT9.LVDS_3_P
EXT9.LVDS_4_N: J18.15 ; port EXT9.LVDS_4_N
EXT9.LVDS_4_P: J18.14 ; port EXT9.LVDS_4_P
EXT9.LVDS_5_N: J18.18 ; port EXT9.LVDS_5_N
EXT9.LVDS_5_P: J18.17 ; port EXT9.LVDS_5_P
EXT9.LVDS_6_N: J18.21 ; port EXT9.LVDS_6_N
EXT9.LVDS_6_P: J18.20 ; port EXT9.LVDS_6_P
EXT9.LVDS_7_N: J18.24 ; port EXT9.LVDS_7_N
EXT9.LVDS_7_P: J18.23 ; port EXT9.LVDS_7_P
EXT10.LVDS_0_N: J19.3 ; port EXT10.LVDS_0_N
EXT10.LVDS_0_P: J19.2 ; port EXT10.LVDS_0_P
EXT10.LVDS_1_N: J19.6 ; port EXT10.LVDS_1_N
EXT10.LVDS_1_P: J19.5 ; port EXT10.LVDS_1_P
EXT10.LVDS_2_N: J19.9 ; port EXT10.LVDS_2_N
EXT10.LVDS_2_P: J19.8 ; port EXT10.LVDS_2_P
EXT10.LVDS_3_N: J19.12 ; port EXT10.LVDS_3_N
EXT10.LVDS_3_P: J19.11 ; port EXT10.LVDS_3_P
EXT10.LVDS_4_N: J19.15 ; port EXT10.LVDS_4_N
EXT10.LVDS_4_P: J19.14 ; port EXT10.LVDS_4_P
EXT10.LVDS_5_N: J19.18 ; port EXT10.LVDS_5_N
EXT10.LVDS_5_P: J19.17 ; port EXT10.LVDS_5_P
EXT10.LVDS_6_N: J19.21 ; port EXT10.LVDS_6_N
EXT10.LVDS_6_P: J19.20 ; port EXT10.LVDS_6_P
EXT10.LVDS_7_N: J19.24 ; port EXT10.LVDS_7_N
EXT10.LVDS_7_P: J19.23 ; port EXT10.LVDS_7_P
EXT11.LVDS_0_N: J20.3 ; port EXT11.LVDS_0_N
EXT11.LVDS_0_P: J20.2 ; port EXT11.LVDS_0_P
EXT11.LVDS_1_N: J20.6 ; port EXT11.LVDS_1_N
EXT11.LVDS_1_P: J20.5 ; port EXT11.LVDS_1_P
EXT11.LVDS_2_N: J20.9 ; port EXT11.LVDS_2_N
EXT11.LVDS_2_P: J20.8 ; port EXT11.LVDS_2_P
EXT11.LVDS_3_N: J20.12 ; port EXT11.LVDS_3_N
EXT11.LVDS_3_P: J20.11 ; port EXT11.LVDS_3_P
EXT11.LVDS_4_N: J20.15 ; port EXT11.LVDS_4_N
EXT11.LVDS_4_P: J20.14 ; port EXT11.LVDS_4_P
EXT11.LVDS_5_N: J20.18 ; port EXT11.LVDS_5_N
EXT11.LVDS_5_P: J20.17 ; port EXT11.LVDS_5_P
EXT11.LVDS_6_N: J20.21 ; port EXT11.LVDS_6_N
EXT11.LVDS_6_P: J20.20 ; port EXT11.LVDS_6_P
EXT11.LVDS_7_N: J20.24 ; port EXT11.LVDS_7_N
EXT11.LVDS_7_P: J20.23 ; port EXT11.LVDS_7_P
I2C_SCL_0: J9.27  [project net I2C_SCL_0_1]
I2C_SCL_1: J10.27  [project net I2C_SCL_1_1]
I2C_SCL_2: J11.27  [project net I2C_SCL_2_1]
I2C_SCL_3: J12.27  [project net I2C_SCL_3_1]
I2C_SCL_4: J13.27  [project net I2C_SCL_4_1]
I2C_SCL_5: J14.27  [project net I2C_SCL_5_1]
I2C_SCL_6: J15.27  [project net I2C_SCL_6_1]
I2C_SCL_7: J16.27  [project net I2C_SCL_7_1]
I2C_SCL_8: J17.27
I2C_SCL_9: J18.27
I2C_SCL_10: J19.27  [project net I2C_SCL_10_1]
I2C_SCL_11: J20.27
I2C_SDA_0: J9.26  [project net I2C_SDA_0_1]
I2C_SDA_1: J10.26  [project net I2C_SDA_1_1]
I2C_SDA_2: J11.26  [project net I2C_SDA_2_1]
I2C_SDA_3: J12.26  [project net I2C_SDA_3_1]
I2C_SDA_4: J13.26  [project net I2C_SDA_4_1]
I2C_SDA_5: J14.26  [project net I2C_SDA_5_1]
I2C_SDA_6: J15.26  [project net I2C_SDA_6_1]
I2C_SDA_7: J16.26  [project net I2C_SDA_7_1]
I2C_SDA_8: J17.26
I2C_SDA_9: J18.26
I2C_SDA_10: J19.26  [project net I2C_SDA_10_1]
I2C_SDA_11: J20.26

### Buses and harness runs
bus I2C_SCL_[11..0] = port I2C_SCL_[11..0]
bus I2C_SDA_[11..0] = port I2C_SDA_[11..0]
harness EXT0 = port EXT0
harness EXT1 = port EXT1
harness EXT2 = port EXT2
harness EXT3 = port EXT3

### Notes on the sheet
- Do not hotplug EEM modules!
- Project/Equipment
- Document
- Designer
- Drawn by
- Check.by
- Copyright WUT 2023.
  This document describes Open Hardware and is licensed under the CERN-OHL-W v2
  You may redistribute and modify this documentation and make products using it under the terms of the CERN-OHL-W v2 (https:/cern.ch/cern-ohl). This documentation is distributed WITHOUT ANY EXPRESS OR IMPLIED WARRANTY, INCLUDING OF MERCHANTABILITY, SATISFACTORY QUALITY AND FITNESS FOR A PARTICULAR PURPOSE. Please see the CERN-OHL-W v2 for applicable conditions.
  Source location: https://github.com/sinara-hw/EEM_FMC_Carrier
  As per CERN-OHL-W v2 section 4, should You produce hardware based on these sources, You must maintain the Source Location visible on the silkscreen or top copper for a EEM FMC Carrier PCB or other product you make using this documentation.
- Contact:
- File
- Last Mod.
- Print Date
- Sheet
- Size
- A3
- of
- Rev

### Library data of the parts
C19-C30 = CC0201_100NF_6.3V_10%_X5R: Non-polarised capacitor; Part Description: SMD Multilayer Chip Ceramic Capacitor; Manufacturer: GENERIC; Manufacturer1 Part Number: 02016D104KAT2A; Voltage: 6.3V; TC: X5R; Tolerance: ±10%; Part Number: CC0201_100NF_6.3V_10%_X5R; Component Kind: Standard; Component Type: Standard; Pin Count: 2; Value: 100nF; Status: Not Recommended; Manufacturer Part Number: CC0201_100NF_6.3V_10%_X5R; Case: 0201; Mounted: Yes; Socket: No; SMD: Yes; Sense: No; Manufacturer1 Example: AVX; Manufacturer1 ComponentHeight: 0.33mm; HelpURL: \\cern.ch\dfs\Applications\Altium\Datasheets\CC0201_X5R_AVX.pdf; Author: CERN DEM JLC; CreateDate: 2007-12-03; LatestRevisionDate: 2007-12-03
J9-J20 = ESW-115-44-L-D: Elevated Socket Strip, 0.100" Pitch (2.54mm) Through Hole Gold, 30 pos, duble row; Manufacturer: Samtec; Pin_count: 30; Created_by: MKI; Checked_by: +++; Mount_technology: THT; Operating_temp: -55°C/+125°C; Part Number: ESW-115-44-L-D; Value: ESW-115-44-L-D; Case: *; Manufacturer_part_number: ESW-115-44-L-D; Type: Header/Socket